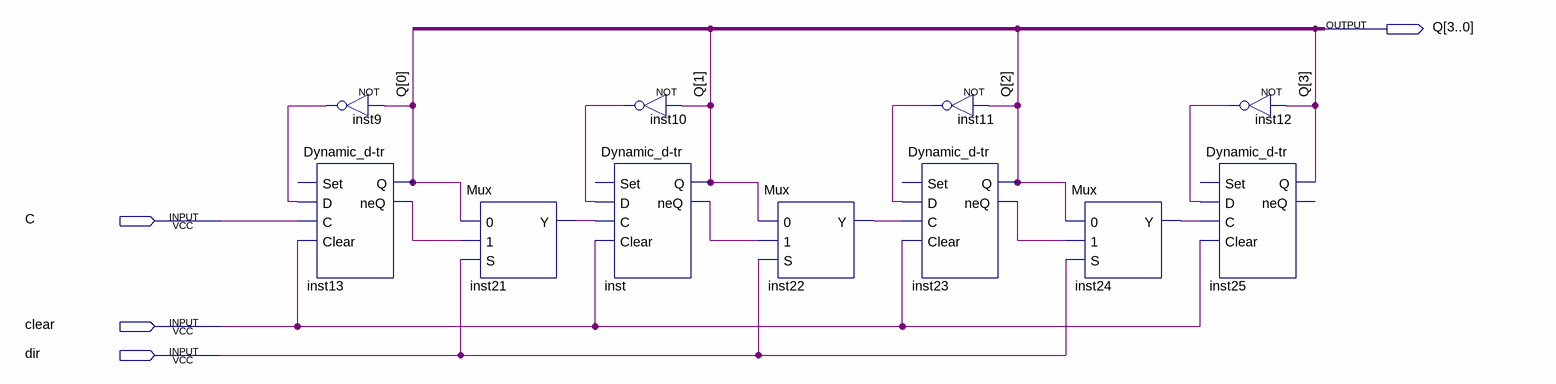
[diagram p0: schematic sheet]
// Quartus schematic Reversible_CNT.bdf as structural Verilog: 11 symbols, 4 pins
module Reversible_CNT (
  input  C,
  input  clear,
  input  dir,
  output [3:0] Q
);

  wire inst9_out, inst10_out, inst11_out, inst12_out, inst13_neq, inst21_y, inst22_y, inst23_neq, inst24_y,
       inst_neq;

  \Dynamic_d-tr  inst13 (.D(inst9_out), .C(C), .Clear(clear), .Q(Q[0]), .neQ(inst13_neq));  // open: Set
  not inst9 (inst9_out, Q[0]);
  Mux inst21 (.\0 (Q[0]), .\1 (inst13_neq), .S(dir), .Y(inst21_y));
  not inst10 (inst10_out, Q[1]);
  \Dynamic_d-tr  inst (.D(inst10_out), .C(inst21_y), .Clear(clear), .Q(Q[1]), .neQ(inst_neq));  // open: Set
  Mux inst22 (.\0 (Q[1]), .\1 (inst_neq), .S(dir), .Y(inst22_y));
  not inst11 (inst11_out, Q[2]);
  \Dynamic_d-tr  inst23 (.D(inst11_out), .C(inst22_y), .Clear(clear), .Q(Q[2]), .neQ(inst23_neq));  // open: Set
  Mux inst24 (.\0 (Q[2]), .\1 (inst23_neq), .S(dir), .Y(inst24_y));
  not inst12 (inst12_out, Q[3]);
  \Dynamic_d-tr  inst25 (.D(inst12_out), .C(inst24_y), .Clear(clear), .Q(Q[3]));  // open: Set, neQ
endmodule
